# Altium schematic sheet Connectors_Sch.SchDoc
size A
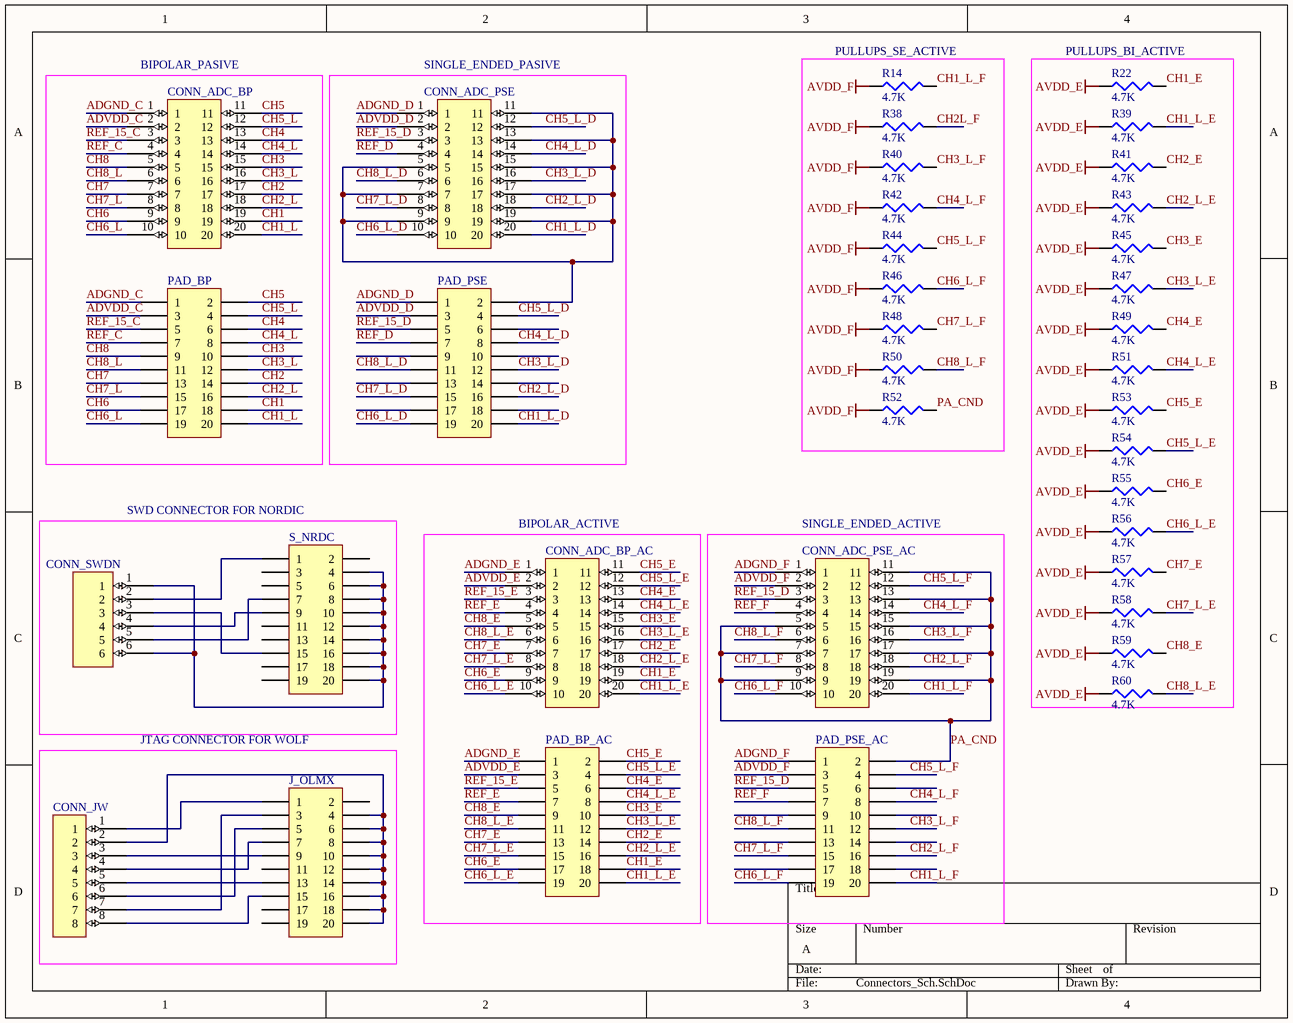
[diagram p0: Connectors_Sch.SchDoc]

## Parts
CONN_ADC_BP  MOLEX_5051102091  [MOLEX_5051102091]  (value not drawn)
CONN_ADC_BP_AC  MOLEX_5051102091  [MOLEX_5051102091]  (value not drawn)
CONN_ADC_PSE  MOLEX_5051102091  [MOLEX_5051102091]  (value not drawn)
CONN_ADC_PSE_AC  MOLEX_5051102091  [MOLEX_5051102091]  (value not drawn)
CONN_JW  MOLEX_5051100892  [MOLEX_5051100892]  (value not drawn)
CONN_SWDN  FFC & FPC Connectors 0.5 FPC ZIF BTM CONT EMBT PKG 6Ckt  [MOLEX_5051100692]  (value not drawn)
J_OLMX  Header 10X2  [HDR2X10]  (value not drawn)
PAD_BP  Header 10X2  [HDR2X10]  (value not drawn)
PAD_BP_AC  Header 10X2  [HDR2X10]  (value not drawn)
PAD_PSE  Header 10X2  [HDR2X10]  (value not drawn)
PAD_PSE_AC  Header 10X2  [HDR2X10]  (value not drawn)
R14  4.7K  [0402]
R22  4.7K  [0402]
R38  4.7K  [0402]
R39  4.7K  [0402]
R40  4.7K  [0402]
R41  4.7K  [0402]
R42  4.7K  [0402]
R43  4.7K  [0402]
R44  4.7K  [0402]
R45  4.7K  [0402]
R46  4.7K  [0402]
R47  4.7K  [0402]
R48  4.7K  [0402]
R49  4.7K  [0402]
R50  4.7K  [0402]
R51  4.7K  [0402]
R52  4.7K  [0402]
R53  4.7K  [0402]
R54  4.7K  [0402]
R55  4.7K  [0402]
R56  4.7K  [0402]
R57  4.7K  [0402]
R58  4.7K  [0402]
R59  4.7K  [0402]
R60  4.7K  [0402]
S_NRDC  Header 10X2  [HDR2X10]  (value not drawn)

## Blocks framed on the sheet
PULLUPS_SE_ACTIVE: R14 R38 R40 R42 R44 R46 R48 R50 R52
PULLUPS_BI_ACTIVE: R22 R39 R41 R43 R45 R47 R49 R51 R53-R60
BIPOLAR_PASIVE: CONN_ADC_BP PAD_BP
SINGLE_ENDED_PASIVE: CONN_ADC_PSE PAD_PSE
SWD CONNECTOR FOR NORDIC: CONN_SWDN S_NRDC
BIPOLAR_ACTIVE: CONN_ADC_BP_AC PAD_BP_AC
SINGLE_ENDED_ACTIVE: CONN_ADC_PSE_AC PAD_PSE_AC
JTAG CONNECTOR FOR WOLF: CONN_JW J_OLMX

## Nets
AVDD_E: R22.1 R39.1 R41.1 R43.1 R45.1 R47.1 R49.1 R51.1 R53.1 R54.1 R55.1 R56.1 R57.1 R58.1 R59.1 R60.1
AVDD_F: R14.1 R38.1 R40.1 R42.1 R44.1 R46.1 R48.1 R50.1 R52.1
ADGND_C: CONN_ADC_BP.1 PAD_BP.1
ADGND_D: CONN_ADC_PSE.1 PAD_PSE.1
ADGND_E: CONN_ADC_BP_AC.1 PAD_BP_AC.1
ADGND_F: CONN_ADC_PSE_AC.1 PAD_PSE_AC.1
ADVDD_C: CONN_ADC_BP.2 PAD_BP.3
ADVDD_D: CONN_ADC_PSE.2 PAD_PSE.3
ADVDD_E: CONN_ADC_BP_AC.2 PAD_BP_AC.3
ADVDD_F: CONN_ADC_PSE_AC.2 PAD_PSE_AC.3
CH1: CONN_ADC_BP.19 PAD_BP.18
CH1_E: CONN_ADC_BP_AC.19 PAD_BP_AC.18 R22.2
CH1_L: CONN_ADC_BP.20 PAD_BP.20
CH1_L_D: CONN_ADC_PSE.20 PAD_PSE.20
CH1_L_E: CONN_ADC_BP_AC.20 PAD_BP_AC.20 R39.2
CH1_L_F: CONN_ADC_PSE_AC.20 PAD_PSE_AC.20 R14.2
CH2: CONN_ADC_BP.17 PAD_BP.14
CH2_E: CONN_ADC_BP_AC.17 PAD_BP_AC.14 R41.2
CH2_L: CONN_ADC_BP.18 PAD_BP.16
CH2_L_D: CONN_ADC_PSE.18 PAD_PSE.16
CH2_L_E: CONN_ADC_BP_AC.18 PAD_BP_AC.16 R43.2
CH2_L_F: CONN_ADC_PSE_AC.18 PAD_PSE_AC.16
CH2L_F: R38.2
CH3: CONN_ADC_BP.15 PAD_BP.10
CH3_E: CONN_ADC_BP_AC.15 PAD_BP_AC.10 R45.2
CH3_L: CONN_ADC_BP.16 PAD_BP.12
CH3_L_D: CONN_ADC_PSE.16 PAD_PSE.12
CH3_L_E: CONN_ADC_BP_AC.16 PAD_BP_AC.12 R47.2
CH3_L_F: CONN_ADC_PSE_AC.16 PAD_PSE_AC.12 R40.2
CH4: CONN_ADC_BP.13 PAD_BP.6
CH4_E: CONN_ADC_BP_AC.13 PAD_BP_AC.6 R49.2
CH4_L: CONN_ADC_BP.14 PAD_BP.8
CH4_L_D: CONN_ADC_PSE.14 PAD_PSE.8
CH4_L_E: CONN_ADC_BP_AC.14 PAD_BP_AC.8 R51.2
CH4_L_F: CONN_ADC_PSE_AC.14 PAD_PSE_AC.8 R42.2
CH5: CONN_ADC_BP.11 PAD_BP.2
CH5_E: CONN_ADC_BP_AC.11 PAD_BP_AC.2 R53.2
CH5_L: CONN_ADC_BP.12 PAD_BP.4
CH5_L_D: CONN_ADC_PSE.12 PAD_PSE.4
CH5_L_E: CONN_ADC_BP_AC.12 PAD_BP_AC.4 R54.2
CH5_L_F: CONN_ADC_PSE_AC.12 PAD_PSE_AC.4 R44.2
CH6: CONN_ADC_BP.9 PAD_BP.17
CH6_E: CONN_ADC_BP_AC.9 PAD_BP_AC.17 R55.2
CH6_L: CONN_ADC_BP.10 PAD_BP.19
CH6_L_D: CONN_ADC_PSE.10 PAD_PSE.19
CH6_L_E: CONN_ADC_BP_AC.10 PAD_BP_AC.19 R56.2
CH6_L_F: CONN_ADC_PSE_AC.10 PAD_PSE_AC.19 R46.2
CH7: CONN_ADC_BP.7 PAD_BP.13
CH7_E: CONN_ADC_BP_AC.7 PAD_BP_AC.13 R57.2
CH7_L: CONN_ADC_BP.8 PAD_BP.15
CH7_L_D: CONN_ADC_PSE.8 PAD_PSE.15
CH7_L_E: CONN_ADC_BP_AC.8 PAD_BP_AC.15 R58.2
CH7_L_F: CONN_ADC_PSE_AC.8 PAD_PSE_AC.15 R48.2
CH8: CONN_ADC_BP.5 PAD_BP.9
CH8_E: CONN_ADC_BP_AC.5 PAD_BP_AC.9 R59.2
CH8_L: CONN_ADC_BP.6 PAD_BP.11
CH8_L_D: CONN_ADC_PSE.6 PAD_PSE.11
CH8_L_E: CONN_ADC_BP_AC.6 PAD_BP_AC.11 R60.2
CH8_L_F: CONN_ADC_PSE_AC.6 PAD_PSE_AC.11 R50.2
PA_CND: CONN_ADC_PSE_AC.5 CONN_ADC_PSE_AC.7 CONN_ADC_PSE_AC.9 CONN_ADC_PSE_AC.11 CONN_ADC_PSE_AC.13 CONN_ADC_PSE_AC.15 CONN_ADC_PSE_AC.17 CONN_ADC_PSE_AC.19 PAD_PSE_AC.2 R52.2
REF_15_C: CONN_ADC_BP.3 PAD_BP.5
REF_15_D: CONN_ADC_PSE.3 CONN_ADC_PSE_AC.3 PAD_PSE.5 PAD_PSE_AC.5
REF_15_E: CONN_ADC_BP_AC.3 PAD_BP_AC.5
REF_C: CONN_ADC_BP.4 PAD_BP.7
REF_D: CONN_ADC_PSE.4 PAD_PSE.7
REF_E: CONN_ADC_BP_AC.4 PAD_BP_AC.7
REF_F: CONN_ADC_PSE_AC.4 PAD_PSE_AC.7
NetCONN_ADC_PSE_5: CONN_ADC_PSE.5 CONN_ADC_PSE.7 CONN_ADC_PSE.9 CONN_ADC_PSE.11 CONN_ADC_PSE.13 CONN_ADC_PSE.15 CONN_ADC_PSE.17 CONN_ADC_PSE.19 PAD_PSE.2
NetCONN_JW_1: CONN_JW.1 J_OLMX.1
NetCONN_JW_2: CONN_JW.2 J_OLMX.4 J_OLMX.6 J_OLMX.8 J_OLMX.10 J_OLMX.12 J_OLMX.14 J_OLMX.16 J_OLMX.18 J_OLMX.20
NetCONN_JW_3: CONN_JW.3 J_OLMX.9
NetCONN_JW_4: CONN_JW.4 J_OLMX.7
NetCONN_JW_5: CONN_JW.5 J_OLMX.13
NetCONN_JW_6: CONN_JW.6 J_OLMX.5
NetCONN_JW_7: CONN_JW.7 J_OLMX.3
NetCONN_JW_8: CONN_JW.8 J_OLMX.15
NetCONN_SWDN_1: CONN_SWDN.1 CONN_SWDN.6 S_NRDC.4 S_NRDC.6 S_NRDC.8 S_NRDC.10 S_NRDC.12 S_NRDC.14 S_NRDC.16 S_NRDC.18 S_NRDC.20
NetCONN_SWDN_2: CONN_SWDN.2 S_NRDC.1
NetCONN_SWDN_3: CONN_SWDN.3 S_NRDC.15
NetCONN_SWDN_4: CONN_SWDN.4 S_NRDC.9
NetCONN_SWDN_5: CONN_SWDN.5 S_NRDC.7

Not connected (* = marked no-connect by the designer): J_OLMX 2 11 17 19; PAD_PSE 6 9 10 13 14 17 18; PAD_PSE_AC 6 9 10 13 14 17 18; S_NRDC 2 3 5 11 13 17 19

## Library data of the parts
CONN_SWDN = MOLEX_5051100692
J_OLMX PAD_BP PAD_BP_AC PAD_PSE PAD_PSE_AC S_NRDC = Header 10X2: Header, 10-Pin, Dual row; LatestRevisionDate: 17-Jul-2002; LatestRevisionNote: Re-released for DXP Platform.; Publisher: Altium Limited
R14 R22 R38-R60 = Res3: Resistor; Published: 8-Jun-2000; LatestRevisionDate: 29-May-2009; LatestRevisionNote: IPC-7351 Footprint Added.; PackageReference: J1-0603; Publisher: Altium Limited; PackageDescription: Chip Resistor; Value: 4.7K